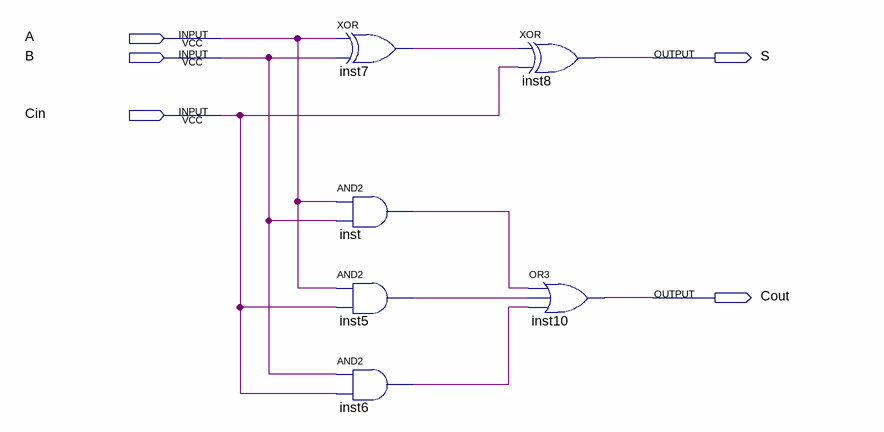
[diagram p0: schematic sheet]
// Quartus schematic FA.bdf as structural Verilog: 6 symbols, 5 pins
module FA (
  input  A,
  input  B,
  input  Cin,
  output S,
  output Cout
);

  wire inst5_out, inst6_out, inst7_out, inst_out;

  xor inst7 (inst7_out, A, B);
  and inst (inst_out, A, B);
  and inst5 (inst5_out, A, Cin);
  and inst6 (inst6_out, B, Cin);
  xor inst8 (S, inst7_out, Cin);
  or inst10 (Cout, inst_out, inst5_out, inst6_out);
endmodule
